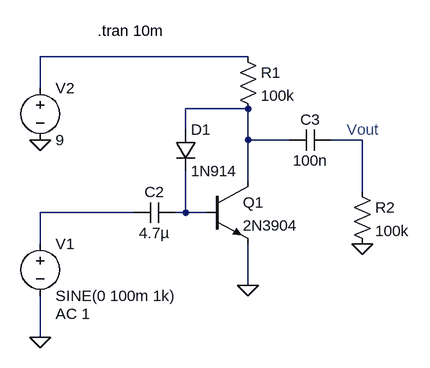
[diagram p0: schematic BassFuzz.asc]
BassFuzz.asc, the LTspice schematic file:
Version 4.1
SHEET 1 880 680
WIRE 208 -96 -112 -96
WIRE -112 -48 -112 -96
WIRE 208 -16 112 -16
WIRE 112 16 112 -16
WIRE 208 32 208 -16
WIRE 272 32 208 32
WIRE 384 32 336 32
WIRE 208 96 208 32
WIRE 384 112 384 32
WIRE 32 144 -112 144
WIRE 112 144 112 80
WIRE 112 144 96 144
WIRE 144 144 112 144
WIRE -112 192 -112 144
WIRE 208 256 208 192
WIRE -112 336 -112 272
FLAG 208 256 0
FLAG -112 336 0
FLAG -112 32 0
FLAG 384 192 0
SYMBOL npn 144 96 R0
SYMATTR InstName Q1
SYMATTR Value 2N3904
SYMBOL cap 96 128 R90
WINDOW 0 0 32 VBottom 2
WINDOW 3 32 32 VTop 2
SYMATTR InstName C2
SYMATTR Value 4.7µ
SYMBOL voltage -112 176 R0
WINDOW 123 24 124 Left 2
WINDOW 39 0 0 Left 0
SYMATTR InstName V1
SYMATTR Value SINE(0 100m 1k)
SYMATTR Value2 AC 1
SYMBOL diode 96 16 R0
SYMATTR InstName D1
SYMATTR Value 1N914
SYMBOL res 192 -112 R0
SYMATTR InstName R1
SYMATTR Value 100k
SYMBOL voltage -112 -64 R0
WINDOW 123 0 0 Left 0
WINDOW 39 0 0 Left 0
SYMATTR InstName V2
SYMATTR Value 9
SYMBOL cap 336 16 R90
WINDOW 0 0 32 VBottom 2
WINDOW 3 32 32 VTop 2
SYMATTR InstName C3
SYMATTR Value 100n
SYMBOL res 368 96 R0
SYMATTR InstName R2
SYMATTR Value 100k
TEXT 360 16 Left 2 ;Vout
TEXT -24 -136 Left 2 !.tran 10m

The netlist it stands for:
* BassFuzz.asc
Q1 N002 N005 0 0 2N3904
C2 N005 N004 4.7µ
V1 N004 0 SINE(0 100m 1k) AC 1
D1 N002 N005 1N914
R1 N001 N002 100k
V2 N001 0 9
C3 N003 N002 100n
R2 N003 0 100k
.model D D
.lib standard.dio
.model NPN NPN
.model PNP PNP
.lib standard.bjt
* Vout
.tran 10m
.backanno
.end